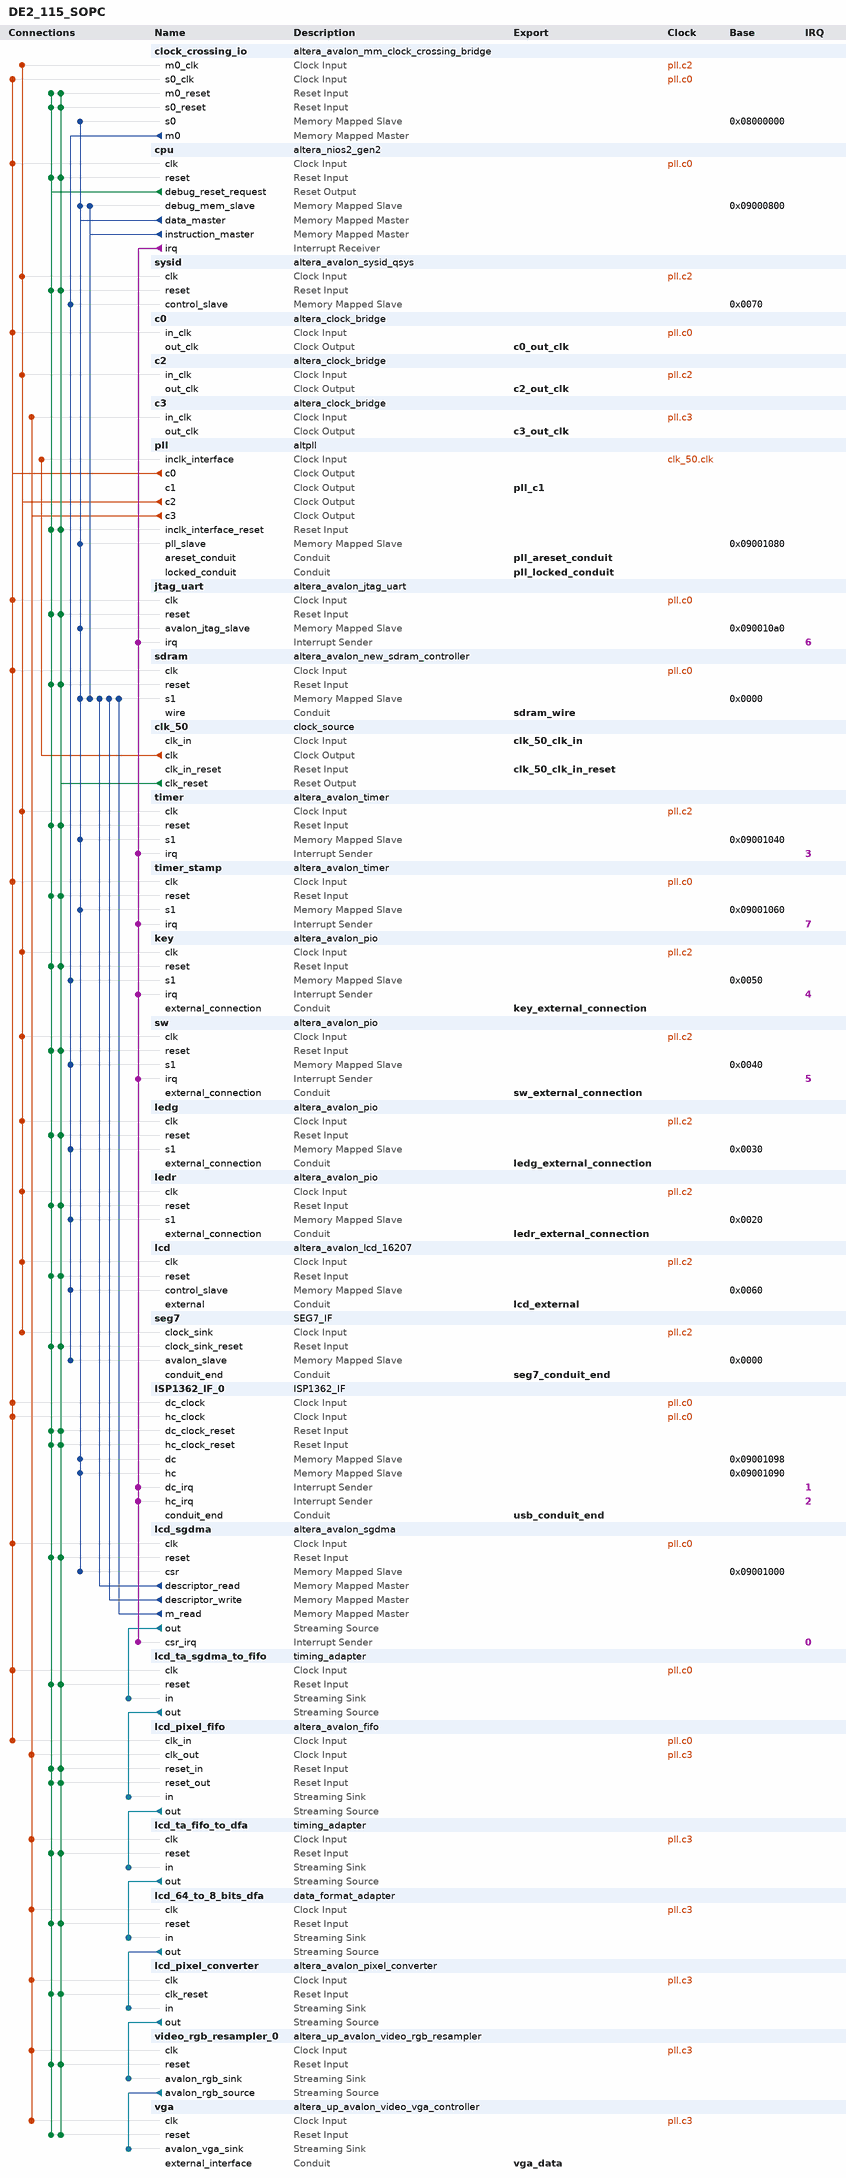
[diagram p0: system contents]
# Platform Designer (Qsys) system DE2_115_SOPC, Cyclone IV E EP4CE115F29C7
# Parameters at their usual value, and those the tool derives, are not listed.
package require -exact qsys 17.0
create_system DE2_115_SOPC
set_project_property DEVICE_FAMILY {Cyclone IV E}
set_project_property DEVICE EP4CE115F29C7

add_instance clock_crossing_io altera_avalon_mm_clock_crossing_bridge 17.0
set_instance_parameter_value clock_crossing_io ADDRESS_WIDTH 22
set_instance_parameter_value clock_crossing_io COMMAND_FIFO_DEPTH 32
set_instance_parameter_value clock_crossing_io DATA_WIDTH 32
set_instance_parameter_value clock_crossing_io MASTER_SYNC_DEPTH 3
set_instance_parameter_value clock_crossing_io MAX_BURST_SIZE 1
set_instance_parameter_value clock_crossing_io RESPONSE_FIFO_DEPTH 256
set_instance_parameter_value clock_crossing_io SLAVE_SYNC_DEPTH 3
set_instance_parameter_value clock_crossing_io USE_AUTO_ADDRESS_WIDTH 0

add_instance cpu altera_nios2_gen2 17.0
set_instance_parameter_value cpu dcache_size 2048
set_instance_parameter_value cpu exceptionSlave sdram.s1
set_instance_parameter_value cpu icache_size 4096
set_instance_parameter_value cpu impl Fast
set_instance_parameter_value cpu resetSlave sdram.s1
set_instance_parameter_value cpu setting_activateTrace true

add_instance sysid altera_avalon_sysid_qsys 17.0
set_instance_parameter_value sysid id 0

add_instance c0 altera_clock_bridge 17.0
set_instance_parameter_value c0 DERIVED_CLOCK_RATE 100000000
set_instance_parameter_value c0 EXPLICIT_CLOCK_RATE 0

add_instance c2 altera_clock_bridge 17.0
set_instance_parameter_value c2 DERIVED_CLOCK_RATE 10000000
set_instance_parameter_value c2 EXPLICIT_CLOCK_RATE 0

add_instance c3 altera_clock_bridge 17.0
set_instance_parameter_value c3 DERIVED_CLOCK_RATE 65000000
set_instance_parameter_value c3 EXPLICIT_CLOCK_RATE 0

add_instance pll altpll 17.0
set_instance_parameter_value pll CLK0_DIVIDE_BY 1
set_instance_parameter_value pll CLK0_MULTIPLY_BY 2
set_instance_parameter_value pll CLK1_DIVIDE_BY 1
set_instance_parameter_value pll CLK1_DUTY_CYCLE 50
set_instance_parameter_value pll CLK1_MULTIPLY_BY 2
set_instance_parameter_value pll CLK1_PHASE_SHIFT -1806
set_instance_parameter_value pll CLK2_DIVIDE_BY 5
set_instance_parameter_value pll CLK2_DUTY_CYCLE 50
set_instance_parameter_value pll CLK2_MULTIPLY_BY 1
set_instance_parameter_value pll CLK2_PHASE_SHIFT 0
set_instance_parameter_value pll CLK3_DIVIDE_BY 10
set_instance_parameter_value pll CLK3_DUTY_CYCLE 50
set_instance_parameter_value pll CLK3_MULTIPLY_BY 13
set_instance_parameter_value pll CLK3_PHASE_SHIFT 0
set_instance_parameter_value pll INCLK0_INPUT_FREQUENCY 20000
set_instance_parameter_value pll PORT_ARESET PORT_USED
set_instance_parameter_value pll PORT_LOCKED PORT_USED
set_instance_parameter_value pll PORT_clk1 PORT_USED
set_instance_parameter_value pll PORT_clk2 PORT_USED
set_instance_parameter_value pll PORT_clk3 PORT_USED

add_instance jtag_uart altera_avalon_jtag_uart 17.0
set_instance_parameter_value jtag_uart simInteractiveOptions INTERACTIVE_ASCII_OUTPUT

add_instance sdram altera_avalon_new_sdram_controller 17.0
set_instance_parameter_value sdram TAC 5.5
set_instance_parameter_value sdram TRCD 20.0
set_instance_parameter_value sdram TRP 20.0
set_instance_parameter_value sdram casLatency 3
set_instance_parameter_value sdram columnWidth 10
set_instance_parameter_value sdram dataWidth 32
set_instance_parameter_value sdram generateSimulationModel true
set_instance_parameter_value sdram model custom
set_instance_parameter_value sdram numberOfBanks 4
set_instance_parameter_value sdram numberOfChipSelects 1
set_instance_parameter_value sdram powerUpDelay 100.0
set_instance_parameter_value sdram refreshPeriod 15.625
set_instance_parameter_value sdram rowWidth 13

add_instance clk_50 clock_source 17.0
set_instance_parameter_value clk_50 clockFrequency 50000000

add_instance timer altera_avalon_timer 17.0
set_instance_parameter_value timer period 1
set_instance_parameter_value timer periodUnits MSEC

add_instance timer_stamp altera_avalon_timer 17.0
set_instance_parameter_value timer_stamp period 1
set_instance_parameter_value timer_stamp periodUnits MSEC

add_instance key altera_avalon_pio 17.0
set_instance_parameter_value key captureEdge true
set_instance_parameter_value key direction Input
set_instance_parameter_value key edgeType FALLING
set_instance_parameter_value key generateIRQ true
set_instance_parameter_value key irqType EDGE
set_instance_parameter_value key width 4

add_instance sw altera_avalon_pio 17.0
set_instance_parameter_value sw captureEdge true
set_instance_parameter_value sw direction Input
set_instance_parameter_value sw edgeType FALLING
set_instance_parameter_value sw generateIRQ true
set_instance_parameter_value sw irqType EDGE
set_instance_parameter_value sw width 18

add_instance ledg altera_avalon_pio 17.0
set_instance_parameter_value ledg direction Output
set_instance_parameter_value ledg width 9

add_instance ledr altera_avalon_pio 17.0
set_instance_parameter_value ledr direction Output
set_instance_parameter_value ledr width 18

add_instance lcd altera_avalon_lcd_16207 17.0

add_instance seg7 SEG7_IF 1.0
set_instance_parameter_value seg7 SEG7_NUM 8

add_instance ISP1362_IF_0 ISP1362_IF 1.0

add_instance lcd_sgdma altera_avalon_sgdma 17.0
set_instance_parameter_value lcd_sgdma enableBurstTransfers false
set_instance_parameter_value lcd_sgdma enableUnalignedTransfers false
set_instance_parameter_value lcd_sgdma readBlockDataWidth 32
set_instance_parameter_value lcd_sgdma sinkErrorWidth 0
set_instance_parameter_value lcd_sgdma sourceErrorWidth 0
set_instance_parameter_value lcd_sgdma transferMode MEMORY_TO_STREAM
set_instance_parameter_value lcd_sgdma writeBurstcountWidth 4

add_instance lcd_ta_sgdma_to_fifo timing_adapter 17.0
set_instance_parameter_value lcd_ta_sgdma_to_fifo inBitsPerSymbol 8
set_instance_parameter_value lcd_ta_sgdma_to_fifo inChannelWidth 0
set_instance_parameter_value lcd_ta_sgdma_to_fifo inErrorWidth 0
set_instance_parameter_value lcd_ta_sgdma_to_fifo inMaxChannel 0
set_instance_parameter_value lcd_ta_sgdma_to_fifo inReadyLatency 0
set_instance_parameter_value lcd_ta_sgdma_to_fifo inSymbolsPerBeat 8
set_instance_parameter_value lcd_ta_sgdma_to_fifo inUseEmptyPort AUTO
set_instance_parameter_value lcd_ta_sgdma_to_fifo inUsePackets true
set_instance_parameter_value lcd_ta_sgdma_to_fifo inUseReady true
set_instance_parameter_value lcd_ta_sgdma_to_fifo inUseValid true
set_instance_parameter_value lcd_ta_sgdma_to_fifo outReadyLatency 1
set_instance_parameter_value lcd_ta_sgdma_to_fifo outUseReady true
set_instance_parameter_value lcd_ta_sgdma_to_fifo outUseValid true

add_instance lcd_pixel_fifo altera_avalon_fifo 17.0
set_instance_parameter_value lcd_pixel_fifo bitsPerSymbol 8
set_instance_parameter_value lcd_pixel_fifo channelWidth 0
set_instance_parameter_value lcd_pixel_fifo errorWidth 0
set_instance_parameter_value lcd_pixel_fifo fifoDepth 256
set_instance_parameter_value lcd_pixel_fifo fifoInputInterfaceOptions AVALONST_SINK
set_instance_parameter_value lcd_pixel_fifo fifoOutputInterfaceOptions AVALONST_SOURCE
set_instance_parameter_value lcd_pixel_fifo singleClockMode false
set_instance_parameter_value lcd_pixel_fifo symbolsPerBeat 8
set_instance_parameter_value lcd_pixel_fifo useIRQ true
set_instance_parameter_value lcd_pixel_fifo usePacket true
set_instance_parameter_value lcd_pixel_fifo useReadControl false
set_instance_parameter_value lcd_pixel_fifo useWriteControl false

add_instance lcd_ta_fifo_to_dfa timing_adapter 17.0
set_instance_parameter_value lcd_ta_fifo_to_dfa inBitsPerSymbol 8
set_instance_parameter_value lcd_ta_fifo_to_dfa inChannelWidth 0
set_instance_parameter_value lcd_ta_fifo_to_dfa inErrorWidth 0
set_instance_parameter_value lcd_ta_fifo_to_dfa inMaxChannel 0
set_instance_parameter_value lcd_ta_fifo_to_dfa inReadyLatency 1
set_instance_parameter_value lcd_ta_fifo_to_dfa inSymbolsPerBeat 8
set_instance_parameter_value lcd_ta_fifo_to_dfa inUseEmptyPort AUTO
set_instance_parameter_value lcd_ta_fifo_to_dfa inUsePackets true
set_instance_parameter_value lcd_ta_fifo_to_dfa inUseReady true
set_instance_parameter_value lcd_ta_fifo_to_dfa inUseValid true
set_instance_parameter_value lcd_ta_fifo_to_dfa outReadyLatency 0
set_instance_parameter_value lcd_ta_fifo_to_dfa outUseReady true
set_instance_parameter_value lcd_ta_fifo_to_dfa outUseValid true

add_instance lcd_64_to_8_bits_dfa data_format_adapter 17.0
set_instance_parameter_value lcd_64_to_8_bits_dfa inBitsPerSymbol 8
set_instance_parameter_value lcd_64_to_8_bits_dfa inChannelWidth 0
set_instance_parameter_value lcd_64_to_8_bits_dfa inErrorWidth 0
set_instance_parameter_value lcd_64_to_8_bits_dfa inMaxChannel 0
set_instance_parameter_value lcd_64_to_8_bits_dfa inReadyLatency 0
set_instance_parameter_value lcd_64_to_8_bits_dfa inSymbolsPerBeat 8
set_instance_parameter_value lcd_64_to_8_bits_dfa inUseEmpty false
set_instance_parameter_value lcd_64_to_8_bits_dfa inUseEmptyPort AUTO
set_instance_parameter_value lcd_64_to_8_bits_dfa inUsePackets true
set_instance_parameter_value lcd_64_to_8_bits_dfa outSymbolsPerBeat 4
set_instance_parameter_value lcd_64_to_8_bits_dfa outUseEmpty false
set_instance_parameter_value lcd_64_to_8_bits_dfa outUseEmptyPort AUTO

add_instance lcd_pixel_converter altera_avalon_pixel_converter 17.0
set_instance_parameter_value lcd_pixel_converter SOURCE_SYMBOLS_PER_BEAT 3

add_instance video_rgb_resampler_0 altera_up_avalon_video_rgb_resampler 17.0
set_instance_parameter_value video_rgb_resampler_0 alpha 1023
set_instance_parameter_value video_rgb_resampler_0 input_type {24-bit RGB}
set_instance_parameter_value video_rgb_resampler_0 output_type {30-bit RGB}

add_instance vga altera_up_avalon_video_vga_controller 17.0
set_instance_parameter_value vga board DE2-115
set_instance_parameter_value vga resolution {XGA 1024x768}

# connections
add_connection clk_50.clk pll.inclk_interface clock
add_connection pll.c0 c0.in_clk clock
add_connection pll.c0 clock_crossing_io.s0_clk clock
add_connection pll.c0 cpu.clk clock
add_connection pll.c0 ISP1362_IF_0.dc_clock clock
add_connection pll.c0 ISP1362_IF_0.hc_clock clock
add_connection pll.c0 jtag_uart.clk clock
add_connection pll.c0 lcd_pixel_fifo.clk_in clock
add_connection pll.c0 lcd_sgdma.clk clock
add_connection pll.c0 lcd_ta_sgdma_to_fifo.clk clock
add_connection pll.c0 sdram.clk clock
add_connection pll.c0 timer_stamp.clk clock
add_connection pll.c2 c2.in_clk clock
add_connection pll.c2 clock_crossing_io.m0_clk clock
add_connection pll.c2 key.clk clock
add_connection pll.c2 lcd.clk clock
add_connection pll.c2 ledg.clk clock
add_connection pll.c2 ledr.clk clock
add_connection pll.c2 seg7.clock_sink clock
add_connection pll.c2 sw.clk clock
add_connection pll.c2 sysid.clk clock
add_connection pll.c2 timer.clk clock
add_connection pll.c3 c3.in_clk clock
add_connection pll.c3 lcd_64_to_8_bits_dfa.clk clock
add_connection pll.c3 lcd_pixel_converter.clk clock
add_connection pll.c3 lcd_pixel_fifo.clk_out clock
add_connection pll.c3 lcd_ta_fifo_to_dfa.clk clock
add_connection pll.c3 vga.clk clock
add_connection pll.c3 video_rgb_resampler_0.clk clock
add_connection clk_50.clk_reset clock_crossing_io.m0_reset reset
add_connection clk_50.clk_reset clock_crossing_io.s0_reset reset
add_connection clk_50.clk_reset cpu.reset reset
add_connection clk_50.clk_reset ISP1362_IF_0.dc_clock_reset reset
add_connection clk_50.clk_reset ISP1362_IF_0.hc_clock_reset reset
add_connection clk_50.clk_reset jtag_uart.reset reset
add_connection clk_50.clk_reset key.reset reset
add_connection clk_50.clk_reset lcd.reset reset
add_connection clk_50.clk_reset lcd_64_to_8_bits_dfa.reset reset
add_connection clk_50.clk_reset lcd_pixel_converter.clk_reset reset
add_connection clk_50.clk_reset lcd_pixel_fifo.reset_in reset
add_connection clk_50.clk_reset lcd_pixel_fifo.reset_out reset
add_connection clk_50.clk_reset lcd_sgdma.reset reset
add_connection clk_50.clk_reset lcd_ta_fifo_to_dfa.reset reset
add_connection clk_50.clk_reset lcd_ta_sgdma_to_fifo.reset reset
add_connection clk_50.clk_reset ledg.reset reset
add_connection clk_50.clk_reset ledr.reset reset
add_connection clk_50.clk_reset pll.inclk_interface_reset reset
add_connection clk_50.clk_reset sdram.reset reset
add_connection clk_50.clk_reset seg7.clock_sink_reset reset
add_connection clk_50.clk_reset sw.reset reset
add_connection clk_50.clk_reset sysid.reset reset
add_connection clk_50.clk_reset timer.reset reset
add_connection clk_50.clk_reset timer_stamp.reset reset
add_connection clk_50.clk_reset vga.reset reset
add_connection clk_50.clk_reset video_rgb_resampler_0.reset reset
add_connection cpu.debug_reset_request clock_crossing_io.m0_reset reset
add_connection cpu.debug_reset_request clock_crossing_io.s0_reset reset
add_connection cpu.debug_reset_request cpu.reset reset
add_connection cpu.debug_reset_request ISP1362_IF_0.dc_clock_reset reset
add_connection cpu.debug_reset_request ISP1362_IF_0.hc_clock_reset reset
add_connection cpu.debug_reset_request jtag_uart.reset reset
add_connection cpu.debug_reset_request key.reset reset
add_connection cpu.debug_reset_request lcd.reset reset
add_connection cpu.debug_reset_request lcd_64_to_8_bits_dfa.reset reset
add_connection cpu.debug_reset_request lcd_pixel_converter.clk_reset reset
add_connection cpu.debug_reset_request lcd_pixel_fifo.reset_in reset
add_connection cpu.debug_reset_request lcd_pixel_fifo.reset_out reset
add_connection cpu.debug_reset_request lcd_sgdma.reset reset
add_connection cpu.debug_reset_request lcd_ta_fifo_to_dfa.reset reset
add_connection cpu.debug_reset_request lcd_ta_sgdma_to_fifo.reset reset
add_connection cpu.debug_reset_request ledg.reset reset
add_connection cpu.debug_reset_request ledr.reset reset
add_connection cpu.debug_reset_request pll.inclk_interface_reset reset
add_connection cpu.debug_reset_request sdram.reset reset
add_connection cpu.debug_reset_request seg7.clock_sink_reset reset
add_connection cpu.debug_reset_request sw.reset reset
add_connection cpu.debug_reset_request sysid.reset reset
add_connection cpu.debug_reset_request timer.reset reset
add_connection cpu.debug_reset_request timer_stamp.reset reset
add_connection cpu.debug_reset_request vga.reset reset
add_connection cpu.debug_reset_request video_rgb_resampler_0.reset reset
add_connection clock_crossing_io.m0 key.s1 avalon
set_connection_parameter_value clock_crossing_io.m0/key.s1 baseAddress 0x0050
add_connection clock_crossing_io.m0 lcd.control_slave avalon
set_connection_parameter_value clock_crossing_io.m0/lcd.control_slave baseAddress 0x0060
add_connection clock_crossing_io.m0 ledg.s1 avalon
set_connection_parameter_value clock_crossing_io.m0/ledg.s1 baseAddress 0x0030
add_connection clock_crossing_io.m0 ledr.s1 avalon
set_connection_parameter_value clock_crossing_io.m0/ledr.s1 baseAddress 0x0020
add_connection clock_crossing_io.m0 seg7.avalon_slave avalon
set_connection_parameter_value clock_crossing_io.m0/seg7.avalon_slave baseAddress 0x0000
add_connection clock_crossing_io.m0 sw.s1 avalon
set_connection_parameter_value clock_crossing_io.m0/sw.s1 baseAddress 0x0040
add_connection clock_crossing_io.m0 sysid.control_slave avalon
set_connection_parameter_value clock_crossing_io.m0/sysid.control_slave baseAddress 0x0070
add_connection cpu.data_master clock_crossing_io.s0 avalon
set_connection_parameter_value cpu.data_master/clock_crossing_io.s0 baseAddress 0x08000000
add_connection cpu.data_master cpu.debug_mem_slave avalon
set_connection_parameter_value cpu.data_master/cpu.debug_mem_slave baseAddress 0x09000800
add_connection cpu.data_master ISP1362_IF_0.dc avalon
set_connection_parameter_value cpu.data_master/ISP1362_IF_0.dc baseAddress 0x09001098
add_connection cpu.data_master ISP1362_IF_0.hc avalon
set_connection_parameter_value cpu.data_master/ISP1362_IF_0.hc baseAddress 0x09001090
add_connection cpu.data_master jtag_uart.avalon_jtag_slave avalon
set_connection_parameter_value cpu.data_master/jtag_uart.avalon_jtag_slave baseAddress 0x090010a0
add_connection cpu.data_master lcd_sgdma.csr avalon
set_connection_parameter_value cpu.data_master/lcd_sgdma.csr baseAddress 0x09001000
add_connection cpu.data_master pll.pll_slave avalon
set_connection_parameter_value cpu.data_master/pll.pll_slave baseAddress 0x09001080
add_connection cpu.data_master sdram.s1 avalon
set_connection_parameter_value cpu.data_master/sdram.s1 baseAddress 0x0000
add_connection cpu.data_master timer.s1 avalon
set_connection_parameter_value cpu.data_master/timer.s1 baseAddress 0x09001040
add_connection cpu.data_master timer_stamp.s1 avalon
set_connection_parameter_value cpu.data_master/timer_stamp.s1 baseAddress 0x09001060
add_connection cpu.instruction_master cpu.debug_mem_slave avalon
set_connection_parameter_value cpu.instruction_master/cpu.debug_mem_slave baseAddress 0x09000800
add_connection cpu.instruction_master sdram.s1 avalon
set_connection_parameter_value cpu.instruction_master/sdram.s1 baseAddress 0x0000
add_connection lcd_sgdma.descriptor_read sdram.s1 avalon
set_connection_parameter_value lcd_sgdma.descriptor_read/sdram.s1 baseAddress 0x0000
add_connection lcd_sgdma.descriptor_write sdram.s1 avalon
set_connection_parameter_value lcd_sgdma.descriptor_write/sdram.s1 baseAddress 0x0000
add_connection lcd_sgdma.m_read sdram.s1 avalon
set_connection_parameter_value lcd_sgdma.m_read/sdram.s1 baseAddress 0x0000
add_connection lcd_64_to_8_bits_dfa.out lcd_pixel_converter.in avalon_streaming
add_connection lcd_pixel_converter.out video_rgb_resampler_0.avalon_rgb_sink avalon_streaming
add_connection lcd_pixel_fifo.out lcd_ta_fifo_to_dfa.in avalon_streaming
add_connection lcd_sgdma.out lcd_ta_sgdma_to_fifo.in avalon_streaming
add_connection lcd_ta_fifo_to_dfa.out lcd_64_to_8_bits_dfa.in avalon_streaming
add_connection lcd_ta_sgdma_to_fifo.out lcd_pixel_fifo.in avalon_streaming
add_connection video_rgb_resampler_0.avalon_rgb_source vga.avalon_vga_sink avalon_streaming
add_connection cpu.irq ISP1362_IF_0.dc_irq interrupt
set_connection_parameter_value cpu.irq/ISP1362_IF_0.dc_irq irqNumber 1
add_connection cpu.irq ISP1362_IF_0.hc_irq interrupt
set_connection_parameter_value cpu.irq/ISP1362_IF_0.hc_irq irqNumber 2
add_connection cpu.irq jtag_uart.irq interrupt
set_connection_parameter_value cpu.irq/jtag_uart.irq irqNumber 6
add_connection cpu.irq key.irq interrupt
set_connection_parameter_value cpu.irq/key.irq irqNumber 4
add_connection cpu.irq lcd_sgdma.csr_irq interrupt
set_connection_parameter_value cpu.irq/lcd_sgdma.csr_irq irqNumber 0
add_connection cpu.irq sw.irq interrupt
set_connection_parameter_value cpu.irq/sw.irq irqNumber 5
add_connection cpu.irq timer.irq interrupt
set_connection_parameter_value cpu.irq/timer.irq irqNumber 3
add_connection cpu.irq timer_stamp.irq interrupt
set_connection_parameter_value cpu.irq/timer_stamp.irq irqNumber 7

# exported interfaces
add_interface c0_out_clk clock source
set_interface_property c0_out_clk EXPORT_OF c0.out_clk
add_interface c2_out_clk clock source
set_interface_property c2_out_clk EXPORT_OF c2.out_clk
add_interface c3_out_clk clock source
set_interface_property c3_out_clk EXPORT_OF c3.out_clk
add_interface clk_50_clk_in clock sink
set_interface_property clk_50_clk_in EXPORT_OF clk_50.clk_in
add_interface clk_50_clk_in_reset reset sink
set_interface_property clk_50_clk_in_reset EXPORT_OF clk_50.clk_in_reset
add_interface key_external_connection conduit end
set_interface_property key_external_connection EXPORT_OF key.external_connection
add_interface lcd_external conduit end
set_interface_property lcd_external EXPORT_OF lcd.external
add_interface ledg_external_connection conduit end
set_interface_property ledg_external_connection EXPORT_OF ledg.external_connection
add_interface ledr_external_connection conduit end
set_interface_property ledr_external_connection EXPORT_OF ledr.external_connection
add_interface pll_areset_conduit conduit end
set_interface_property pll_areset_conduit EXPORT_OF pll.areset_conduit
add_interface pll_c1 clock source
set_interface_property pll_c1 EXPORT_OF pll.c1
add_interface pll_locked_conduit conduit end
set_interface_property pll_locked_conduit EXPORT_OF pll.locked_conduit
add_interface sdram_wire conduit end
set_interface_property sdram_wire EXPORT_OF sdram.wire
add_interface seg7_conduit_end conduit end
set_interface_property seg7_conduit_end EXPORT_OF seg7.conduit_end
add_interface sw_external_connection conduit end
set_interface_property sw_external_connection EXPORT_OF sw.external_connection
add_interface usb_conduit_end conduit end
set_interface_property usb_conduit_end EXPORT_OF ISP1362_IF_0.conduit_end
add_interface vga_data conduit end
set_interface_property vga_data EXPORT_OF vga.external_interface

set_interconnect_requirement {$system} qsys_mm.clockCrossingAdapter HANDSHAKE
set_interconnect_requirement {$system} qsys_mm.maxAdditionalLatency 0

save_system DE2_115_SOPC.qsys
